# Altium schematic sheet PDC_Gate_Driver.SchDoc
size A
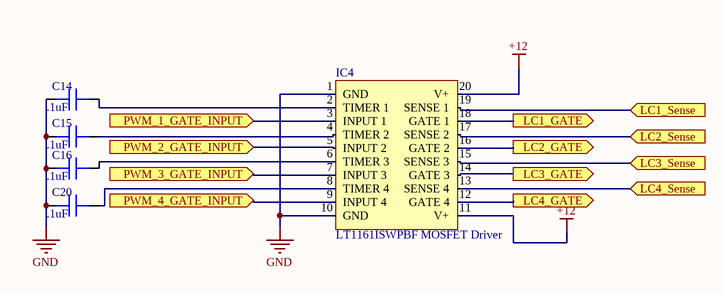
[diagram p0: PDC_Gate_Driver.SchDoc]

## Parts
C14  capacitance: .1uF  [0603]  (hidden comment: capacitor)
C15  capacitance: .1uF  [0603]  (hidden comment: capacitor)
C16  capacitance: .1uF  [0603]  (hidden comment: capacitor)
C20  capacitance: .1uF  [0603]  (hidden comment: capacitor)
IC4  LT1161ISWPBF MOSFET Driver  [SO-20]

## Ports
LC1_GATE (out), LC1_Sense (in), LC2_GATE (out), LC2_Sense (in), LC3_GATE (out), LC3_Sense (in), LC4_GATE (out), LC4_Sense (in), PWM_1_GATE_INPUT (in), PWM_2_GATE_INPUT (in), PWM_3_GATE_INPUT (in), PWM_4_GATE_INPUT (in)

## Nets
+12: IC4.11(V+) IC4.20(V+)
GND: C14.1 C15.1 C16.1 C20.1 IC4.1(GND) IC4.10(GND)
LC1_GATE: IC4.18(GATE_1) ; port LC1_GATE
LC1_Sense: IC4.19(SENSE_1) ; port LC1_Sense
LC2_GATE: IC4.16(GATE_2) ; port LC2_GATE
LC2_Sense: IC4.17(SENSE_2) ; port LC2_Sense
LC3_GATE: IC4.14(GATE_3) ; port LC3_GATE
LC3_Sense: IC4.15(SENSE_3) ; port LC3_Sense
LC4_GATE: IC4.12(GATE_4) ; port LC4_GATE
LC4_Sense: IC4.13(SENSE_4) ; port LC4_Sense
PWM_1_GATE_INPUT: IC4.3(INPUT_1) ; port PWM_1_GATE_INPUT
PWM_2_GATE_INPUT: IC4.5(INPUT_2) ; port PWM_2_GATE_INPUT
PWM_3_GATE_INPUT: IC4.7(INPUT_3) ; port PWM_3_GATE_INPUT
PWM_4_GATE_INPUT: IC4.9(INPUT_4) ; port PWM_4_GATE_INPUT
NetC14_2: C14.2 IC4.2(TIMER_1)
NetC15_2: C15.2 IC4.4(TIMER_2)
NetC16_2: C16.2 IC4.6(TIMER_3)
NetC20_2: C20.2 IC4.8(TIMER_4)

## Library data of the parts
C14-C16 C20 = 1: Generic 0603 capacitor; id: 1; voltage: 50; dielectric: Ceramic; percent tolerance: 10; name: 0603 Capacitor; ESR: 1; package: 0603; quantity: 0
IC4 = 16: Manufacturer_id: 1; idIC_Misc: 16; Created_By: Eunice Bernardo; Drawer_id: 1; Name: LT1161ISWPBF MOSFET Driver; Created_Date: 10/27/2018